# Altium project F103RC_Interface.PrjPcb
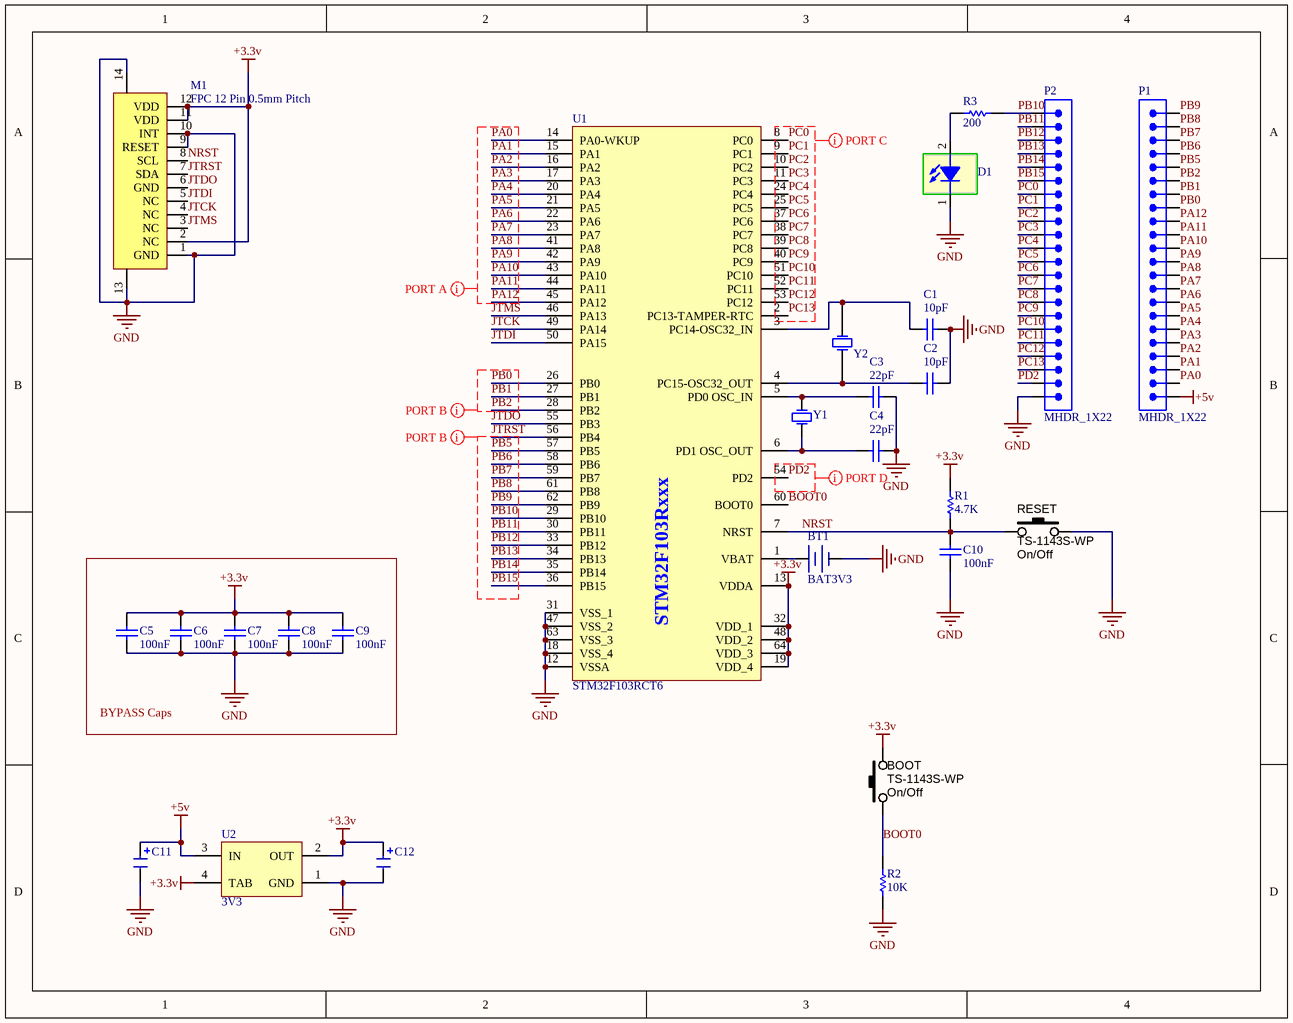
[diagram p0: Sheet1.SchDoc]
1 sheet, 26 parts. Net scope: global (net labels, ports and power ports of the same name join across sheets).
Board file: PCB1.PcbDoc

## Sheet Sheet1.SchDoc
size A; SheetNumber: 1; SheetTotal: 1

### Parts
BOOT  TS-1143S-WP  Function: On/Off  [TS-1143S]
BT1  BAT3V3  [Battery socket SMD]
C1  10pF  [0805 C]
C2  10pF  [0805 C]
C3  22pF  [0805 C]
C4  22pF  [0805 C]
C5  100nF  [0805 C]
C6  100nF  [0805 C]
C7  100nF  [0805 C]
C8  100nF  [0805 C]
C9  100nF  [0805 C]
C10  100nF  [0805 C]
C11  Tantalium Cap  [TANTAL-CAP-Size D]  (value not drawn)
C12  Tantalium Cap  [TANTAL-CAP-Size D]  (value not drawn)
D1  SMD 1206 LED  [LED 1206]  (value not drawn)
M1  FPC 12 Pin 0.5mm Pitch  [FPC 12 Pin 0.5mm Pitch]
P1  MHDR_1X22  [HDR1X22]
P2  MHDR_1X22  [HDR1X22]
R1  4.7K  [0805 R]
R2  10K  [0805 R]
R3  200  [0805 R]
RESET  TS-1143S-WP  Function: On/Off  [TS-1143S]
U1  STM32F103RCT6  [LQFP-64]
U2  3V3  [SOT223]
Y1  16 MHz  [Xtal SMD]  (value not drawn)
Y2  11.0592 MHz  [Xtal 32.782khz]  (value not drawn)

### Blocks framed on the sheet
BYPASS Caps: C5-C9

### Nets
+3.3v: BOOT.2 C5.1 C6.1 C7.1 C8.1 C9.1 C12.1 M1.2(NC) M1.11(VDD) M1.12(VDD) R1.2 U1.13(VDDA) U1.19(VDD_4) U1.32(VDD_1) U1.48(VDD_2) U1.64(VDD_3) U2.2(OUT) U2.4(TAB)
+5v: C11.1 P1.1 U2.3(IN)
GND: BT1.2(-) C1.1 C2.1 C3.1 C4.1 C5.2 C6.2 C7.2 C8.2 C9.2 C10.2 C11.2 C12.2 D1.1 M1.1(GND) M1.9(RESET) M1.10(INT) M1.13(NC) M1.14(NC) P2.22 R2.1 RESET.2 U1.12(VSSA) U1.18(VSS_4) U1.31(VSS_1) U1.47(VSS_2) U1.63(VSS_3) U2.1(GND)
BOOT0: BOOT.1 R2.2 U1.60(BOOT0)
JTCK: M1.4(NC) U1.49(PA14)
JTDI: M1.5(NC) U1.50(PA15)
JTDO: M1.6(GND) U1.55(PB3)
JTMS: M1.3(NC) U1.46(PA13)
JTRST: M1.7(SDA) U1.56(PB4)
NRST: C10.1 M1.8(SCL) R1.1 RESET.1 U1.7(NRST)
PA0: P1.2 U1.14(PA0-WKUP)
PA1: P1.3 U1.15(PA1)
PA2: P1.4 U1.16(PA2)
PA3: P1.5 U1.17(PA3)
PA4: P1.6 U1.20(PA4)
PA5: P1.7 U1.21(PA5)
PA6: P1.8 U1.22(PA6)
PA7: P1.9 U1.23(PA7)
PA8: P1.10 U1.41(PA8)
PA9: P1.11 U1.42(PA9)
PA10: P1.12 U1.43(PA10)
PA11: P1.13 U1.44(PA11)
PA12: P1.14 U1.45(PA12)
PB0: P1.15 U1.26(PB0)
PB1: P1.16 U1.27(PB1)
PB2: P1.17 U1.28(PB2)
PB5: P1.18 U1.57(PB5)
PB6: P1.19 U1.58(PB6)
PB7: P1.20 U1.59(PB7)
PB8: P1.21 U1.61(PB8)
PB9: P1.22 U1.62(PB9)
PB10: P2.1 R3.1 U1.29(PB10)
PB11: P2.2 U1.30(PB11)
PB12: P2.3 U1.33(PB12)
PB13: P2.4 U1.34(PB13)
PB14: P2.5 U1.35(PB14)
PB15: P2.6 U1.36(PB15)
PC0: P2.7 U1.8(PC0)
PC1: P2.8 U1.9(PC1)
PC2: P2.9 U1.10(PC2)
PC3: P2.10 U1.11(PC3)
PC4: P2.11 U1.24(PC4)
PC5: P2.12 U1.25(PC5)
PC6: P2.13 U1.37(PC6)
PC7: P2.14 U1.38(PC7)
PC8: P2.15 U1.39(PC8)
PC9: P2.16 U1.40(PC9)
PC10: P2.17 U1.51(PC10)
PC11: P2.18 U1.52(PC11)
PC12: P2.19 U1.53(PC12)
PC13: P2.20 U1.2(PC13-TAMPER-RTC)
PD2: P2.21 U1.54(PD2)
NetBT1_1: BT1.1(+) U1.1(VBAT)
NetC1_2: C1.2 U1.3(PC14-OSC32_IN) Y2.2(OSC2)
NetC2_2: C2.2 U1.4(PC15-OSC32_OUT) Y2.1(OSC1)
NetC3_2: C3.2 U1.5(PD0_OSC_IN) Y1.2(OSC2)
NetC4_2: C4.2 U1.6(PD1_OSC_OUT) Y1.1(OSC1)
NetD1_2: D1.2 R3.2

### Layout directives
mark named PORT A: PA0, PA1, PA2, PA3, PA4, PA5, PA6, PA7, PA8, PA9, PA10, PA11, PA12
mark named PORT B: JTRST, PB0, PB1, PB2, PB5, PB6, PB7, PB8, PB9, PB10, PB11, PB12, PB13, PB14, PB15
mark named PORT C: PC0, PC1, PC2, PC3, PC4, PC5, PC6, PC7, PC8, PC9, PC10, PC11, PC12, PC13
mark named PORT D: PD2

### Library data of the parts
BOOT RESET = SW_SMD_PB_4.3mm: Switch SMD Tact 4.3mm Stem; Manufacturer 1: Bond-Tact; Manufacturer Part Number 1: TS-1143S-WP-200; SCDType: spec; Package / Case: 6.5x6.5mm; 4.3mm stem
BT1 = Battry Backup: Designer: Abbas Basereh; Data: 16-12-2016; Link: *; Part. No: *
C1-C10 = CAP SMD 0805: CAP 0805; Designer: Abbas Basereh; Desc.: CAP SMD 0805; Data: 16-12-2016
C11 C12 = Capacitor Tantalium
D1 = LED SMD 1206
P1 P2 = MHDR_1X22: Male Header 1X22
R1-R3 = RES 0805 0.125W: RES 0805; Designer: Abbas Basereh; Desc.: RES SMD 0805; Data: 16-12-2016
U1 = STM32F103Rxxx
U2 = AMS1117-x.x: x.x Volt, 800mA Low-Dropout Linear Regulator, 4-pin SOT-223; Designer: Ali Hafizi; Data: 16-12-2016
Y1 = XTAL: XTAL Crystal; Designer: ABBAS BASEREH; Design Date: 2017-1-3; ComponentLink1Description: Datasheet; ComponentLink2Description: Reference; Mounting Technology: Surface Mount\Through-Hole; Value: 16 MHz; Status: Unreleased
Y2 = XTAL_Crystal: XTAL Crystal; Company: SJ Libraries; Designer: Eng. Saeid Jorablo; Design Date: 11/04/2011; ComponentLink1Description: Datasheet; ComponentLink2Description: Reference; Publisher: SJ Unlimited; Mounting Technology: Surface Mount\Through-Hole; Value: 11.0592 MHz; HelpURL: http://s3.picofile.com/file/7443264187/Coming_Soon_logo.gif; Status: Unreleased